# EAGLE design wimax-cpe (EAGLE 9.6.2)
WiMAX CPE Wallplug: mains-powered PCI Express Mini Card carrier for an IEEE 802.16e WiMAX modem (Intel Centrino Advanced-N + WiMAX 6250), USB 2.0 to the host
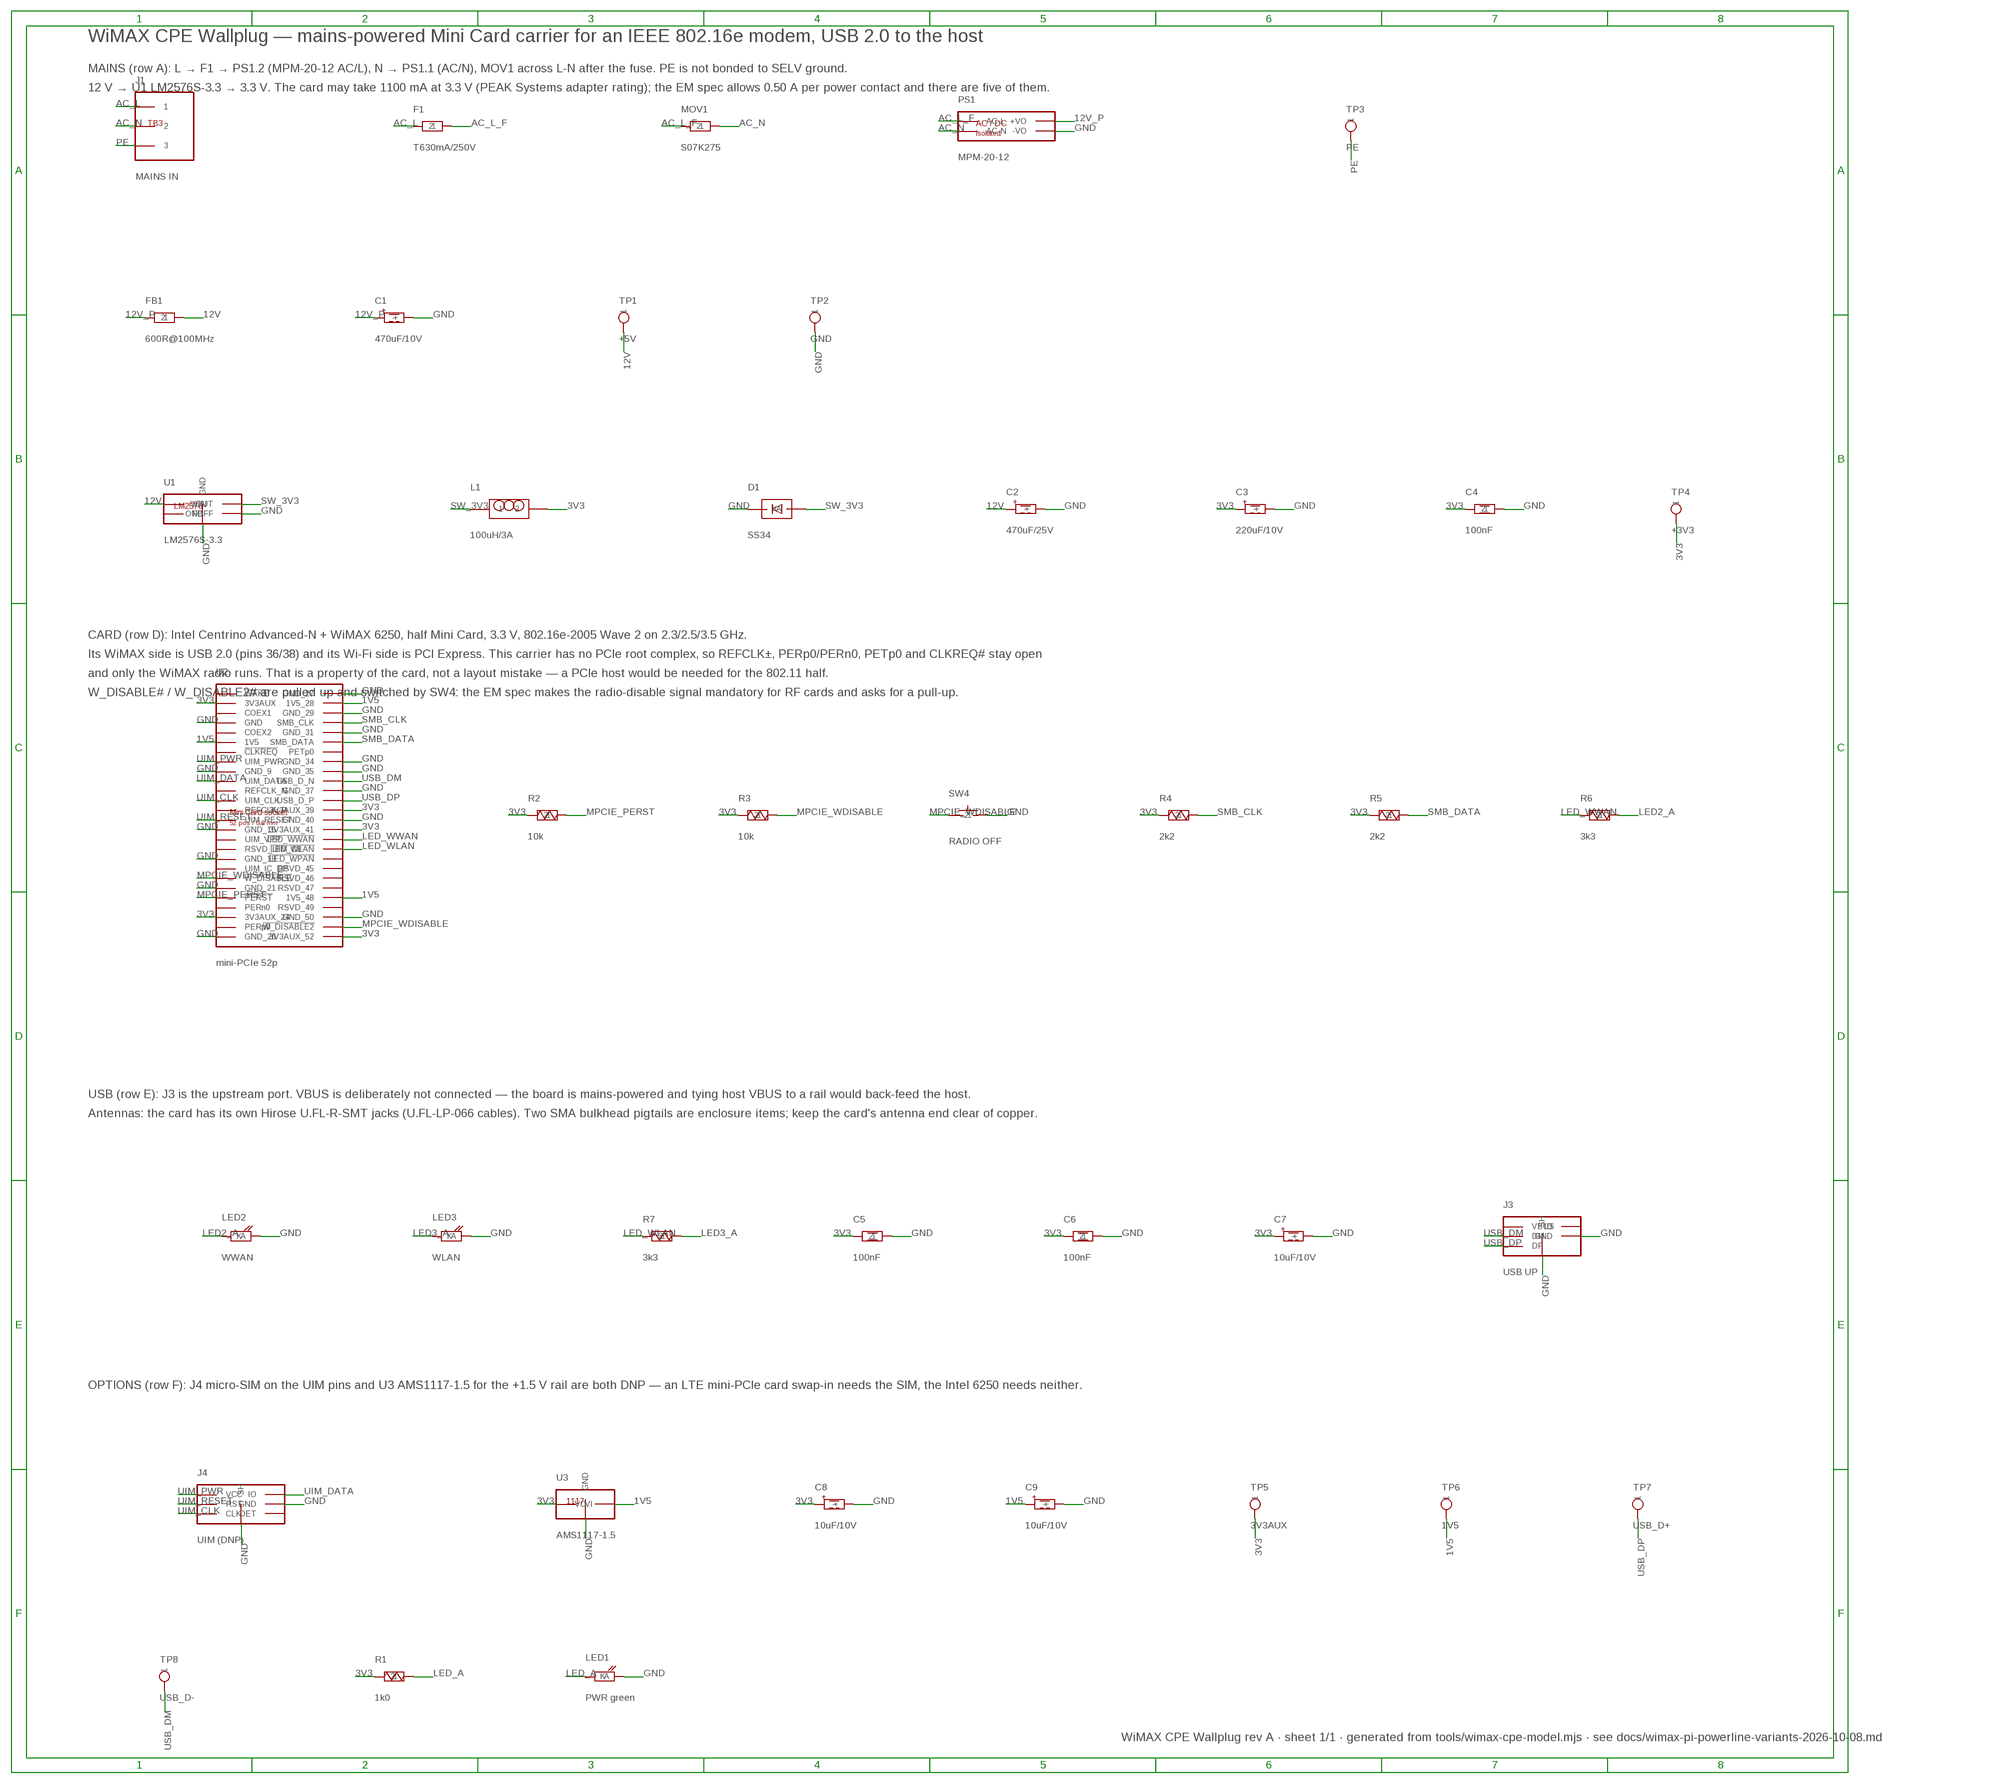
[diagram p0: schematic, sheet 1]

## Parts
C1  470uF/10V  CPOL-EU  [CP-D10-P5]
C2  470uF/25V  CPOL-EU  [CP-D10-P5]
C3  220uF/10V  CPOL-EU  [CP-D10-P5]
C4  100nF  C-0603  [C0603]
C5  100nF  C-0603  [C0603]
C6  100nF  C-0603  [C0603]
C7  10uF/10V  CPOL-SMALL  [CP-D6.3-P2.5]
C8  10uF/10V  CPOL-SMALL  [CP-D6.3-P2.5]
C9  10uF/10V  CPOL-SMALL  [CP-D6.3-P2.5]
D1  SS34  DIODE-SCH  [DO41]
F1  T630mA/250V  FUSE  [FUSE-RADIAL]
FB1  600R@100MHz  FERRITE  [FB-7.62]
J1  MAINS IN  TERM-3  [CUI_TB003]
J3  USB UP  USB-MICRO-B  [USBMB]
J4  UIM (DNP)  MICRO-SIM  [MICROSIM]
L1  100uH/3A  L-RADIAL  [LRAD12]
LED1  PWR green  LED  [LED-5MM]
LED2  WWAN  LED  [LED-5MM]
LED3  WLAN  LED  [LED-5MM]
MOV1  S07K275  MOV  [MOV07]
PS1  MPM-20-12  ACDC-12V  [MPM2012]
R1  1k0  R-EU  [R-7.62]
R2  10k  R-EU  [R-7.62]
R3  10k  R-EU  [R-7.62]
R4  2k2  R-EU  [R-7.62]
R5  2k2  R-EU  [R-7.62]
R6  3k3  R-EU  [R-7.62]
R7  3k3  R-EU  [R-7.62]
SW4  RADIO OFF  SW-PUSH  [SW-TACT-6MM]
TP1  +5V  TP  [TP]
TP2  GND  TP  [TP]
TP3  PE  TP  [TP]
TP4  +3V3  TP  [TP]
TP5  3V3AUX  TP  [TP]
TP6  1V5  TP  [TP]
TP7  USB_D+  TP  [TP]
TP8  USB_D-  TP  [TP]
U1  LM2576S-3.3  BUCK-3V3  [LM2576S]
U2  mini-PCIe 52p  MPCIE-SOCKET  [MPCIE]
U3  AMS1117-1.5  LDO-3V3  [AMS1117]

## Nets
1V5 [power]: C9.+ TP6.1 U2.6(1V5) U2.28(1V5_28) U2.48(1V5_48) U3.2(VO) U3.2_2(VO)
3V3 [power]: C3.+ C4.1 C5.1 C6.1 C7.+ C8.+ L1.2 R1.1 R2.1 R3.1 R4.1 R5.1 TP4.1 TP5.1 U2.2(3V3AUX) U2.24(3V3AUX_24) U2.39(3V3AUX_39) U2.41(3V3AUX_41) U2.52(3V3AUX_52) U3.3(VI)
12V [power]: C2.+ FB1.2 TP1.1 U1.1(VIN)
12V_P [power]: C1.+ FB1.1 PS1.3(+VO)
AC_L [mains]: F1.1 J1.1
AC_L_F [mains]: F1.2 MOV1.1 PS1.2(AC-L)
AC_N [mains]: J1.2 MOV1.2 PS1.1(AC-N)
GND [power]: C1.- C2.- C3.- C4.2 C5.2 C6.2 C7.- C8.- C9.- D1.A J3.5(GND) J3.6(SH) J3.6_2(SH) J3.6_3(SH) J3.6_4(SH) J3.6_5(SH) J3.6_6(SH) J3.6_7(SH) J3.6_8(SH) J4.5(GND) J4.SH J4.SH_2(SH) J4.SH_3(SH) J4.SH_4(SH) J4.SH_5(SH) J4.SH_6(SH) J4.SH_7(SH) J4.SH_8(SH) LED1.2(K) LED2.2(K) LED3.2(K) PS1.4(-VO) SW4.2 TP2.1 U1.3(GND) U1.3_2(GND) U1.5(ONOFF) U1.P7(GND) U1.P8(GND) U1.P9(GND) U1.P10(GND) U2.4(GND) U2.9(GND_9) U2.15(GND_15) U2.18(GND_18) U2.21(GND_21) U2.26(GND_26) U2.27(GND_27) U2.29(GND_29) U2.31(GND_31) U2.34(GND_34) U2.35(GND_35) U2.37(GND_37) U2.40(GND_40) U2.50(GND_50) U3.1(GND)
LED2_A: LED2.1(A) R6.2
LED3_A: LED3.1(A) R7.2
LED_A: LED1.1(A) R1.2
LED_WLAN: R7.1 U2.43(!LED_WLAN)
LED_WWAN: R6.1 U2.42(!LED_WWAN)
MPCIE_PERST: R2.2 U2.22(!PERST)
MPCIE_WDISABLE: R3.2 SW4.1 U2.20(!W_DISABLE) U2.51(!W_DISABLE2)
PE [mains]: J1.3 TP3.1
SMB_CLK: R4.2 U2.30(SMB_CLK)
SMB_DATA: R5.2 U2.32(SMB_DATA)
SW_3V3 [power]: D1.K L1.1 U1.2(VOUT)
UIM_CLK: J4.3(CLK) U2.12(UIM_CLK)
UIM_DATA: J4.7(IO) U2.10(UIM_DATA)
UIM_PWR: J4.1(VCC) U2.8(UIM_PWR)
UIM_RESET: J4.2(RST) U2.14(UIM_RESET)
USB_DM: J3.2(DM) TP8.1 U2.36(USB_D_N)
USB_DP: J3.3(DP) TP7.1 U2.38(USB_D_P)
Unconnected: J3.1(VBUS) J3.4(ID) J4.6(DET) U1.4(FB) U2.1(!WAKE) U2.3(COEX1) U2.5(COEX2) U2.7(!CLKREQ) U2.11(REFCLK_N) U2.13(REFCLK_P) U2.16(UIM_VPP) U2.17(RSVD_UIM_C8) U2.19(UIM_IC_DP) U2.23(PERn0) U2.25(PERp0) U2.33(PETp0) U2.44(!LED_WPAN) U2.45(RSVD_45) U2.46(RSVD_46) U2.47(RSVD_47) U2.49(RSVD_49)

## Notes on the sheet
- WiMAX CPE Wallplug — mains-powered Mini Card carrier for an IEEE 802.16e modem, USB 2.0 to the host
- MAINS (row A): L → F1 → PS1.2 (MPM-20-12 AC/L), N → PS1.1 (AC/N), MOV1 across L-N after the fuse. PE is not bonded to SELV ground.
- 12 V → U1 LM2576S-3.3 → 3.3 V. The card may take 1100 mA at 3.3 V (PEAK Systems adapter rating); the EM spec allows 0.50 A per power contact and there are five of them.
- CARD (row D): Intel Centrino Advanced-N + WiMAX 6250, half Mini Card, 3.3 V, 802.16e-2005 Wave 2 on 2.3/2.5/3.5 GHz.
- Its WiMAX side is USB 2.0 (pins 36/38) and its Wi-Fi side is PCI Express. This carrier has no PCIe root complex, so REFCLK±, PERp0/PERn0, PETp0 and CLKREQ# stay open
- and only the WiMAX radio runs. That is a property of the card, not a layout mistake — a PCIe host would be needed for the 802.11 half.
- W_DISABLE# / W_DISABLE2# are pulled up and switched by SW4: the EM spec makes the radio-disable signal mandatory for RF cards and asks for a pull-up.
- USB (row E): J3 is the upstream port. VBUS is deliberately not connected — the board is mains-powered and tying host VBUS to a rail would back-feed the host.
- Antennas: the card has its own Hirose U.FL-R-SMT jacks (U.FL-LP-066 cables). Two SMA bulkhead pigtails are enclosure items; keep the card's antenna end clear of copper.
- OPTIONS (row F): J4 micro-SIM on the UIM pins and U3 AMS1117-1.5 for the +1.5 V rail are both DNP — an LTE mini-PCIe card swap-in needs the SIM, the Intel 6250 needs neither.
- WiMAX CPE Wallplug rev A · sheet 1/1 · generated from tools/wimax-cpe-model.mjs · see docs/wimax-pi-powerline-variants-2026-10-08.md

## Library data of the parts
C1-C3 = wimax-cpe:CPOL-EU
C4-C6 = wimax-cpe:C-0603
C7-C9 = wimax-cpe:CPOL-SMALL
D1 = wimax-cpe:DIODE-SCH
F1 = wimax-cpe:FUSE
FB1 = wimax-cpe:FERRITE
J1 = wimax-cpe:TERM-3
J3 = wimax-cpe:USB-MICRO-B
J4 = wimax-cpe:MICRO-SIM
L1 = wimax-cpe:L-RADIAL
LED1-LED3 = wimax-cpe:LED
MOV1 = wimax-cpe:MOV
PS1 = wimax-cpe:ACDC-12V
R1-R7 = wimax-cpe:R-EU
SW4 = wimax-cpe:SW-PUSH
TP1-TP8 = wimax-cpe:TP
U1 = wimax-cpe:BUCK-3V3
U2 = wimax-cpe:MPCIE-SOCKET
U3 = wimax-cpe:LDO-3V3

## Net classes
0 default: width 0.305 mm
1 mains: width 2.5 mm, clearance 6.4 mm to class 0, clearance 6.4 mm, clearance 6.4 mm to class 2
2 power: width 1 mm, clearance 0.5 mm to class 0, clearance 0.6 mm

## Board
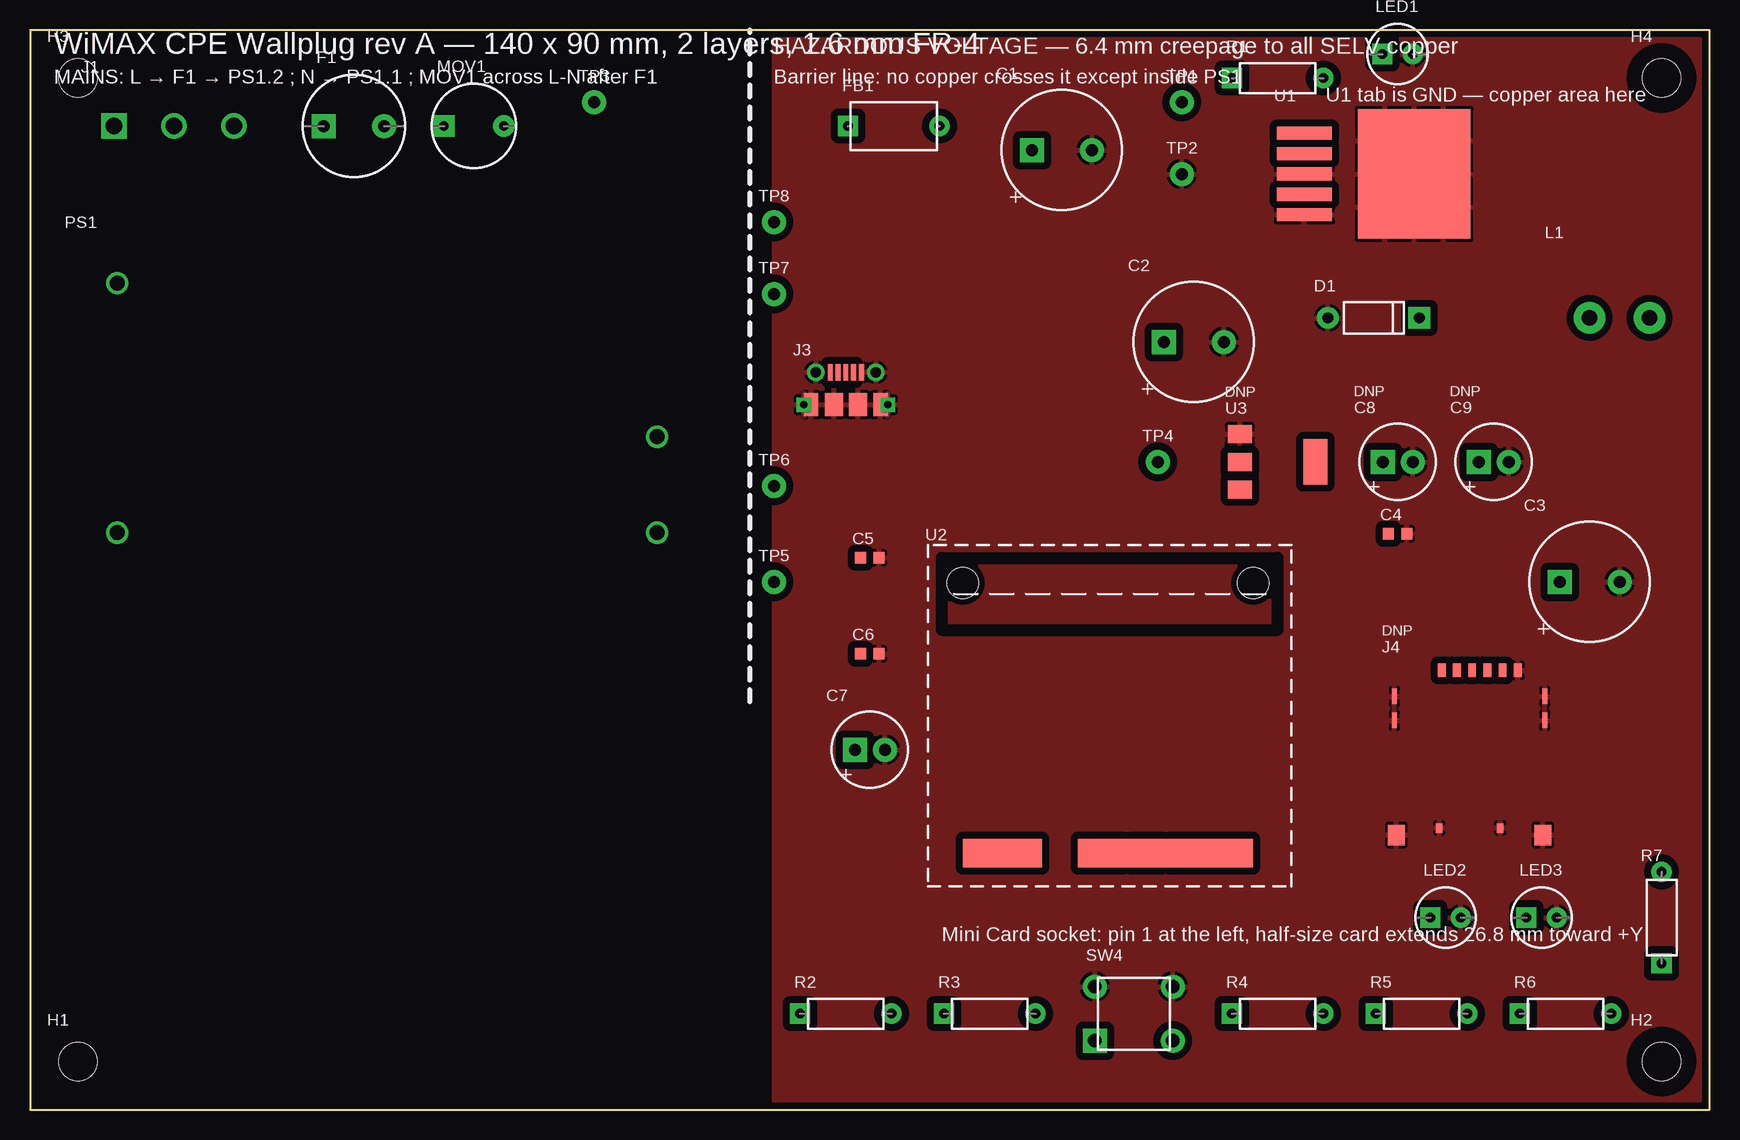
[diagram p1: board, top side]
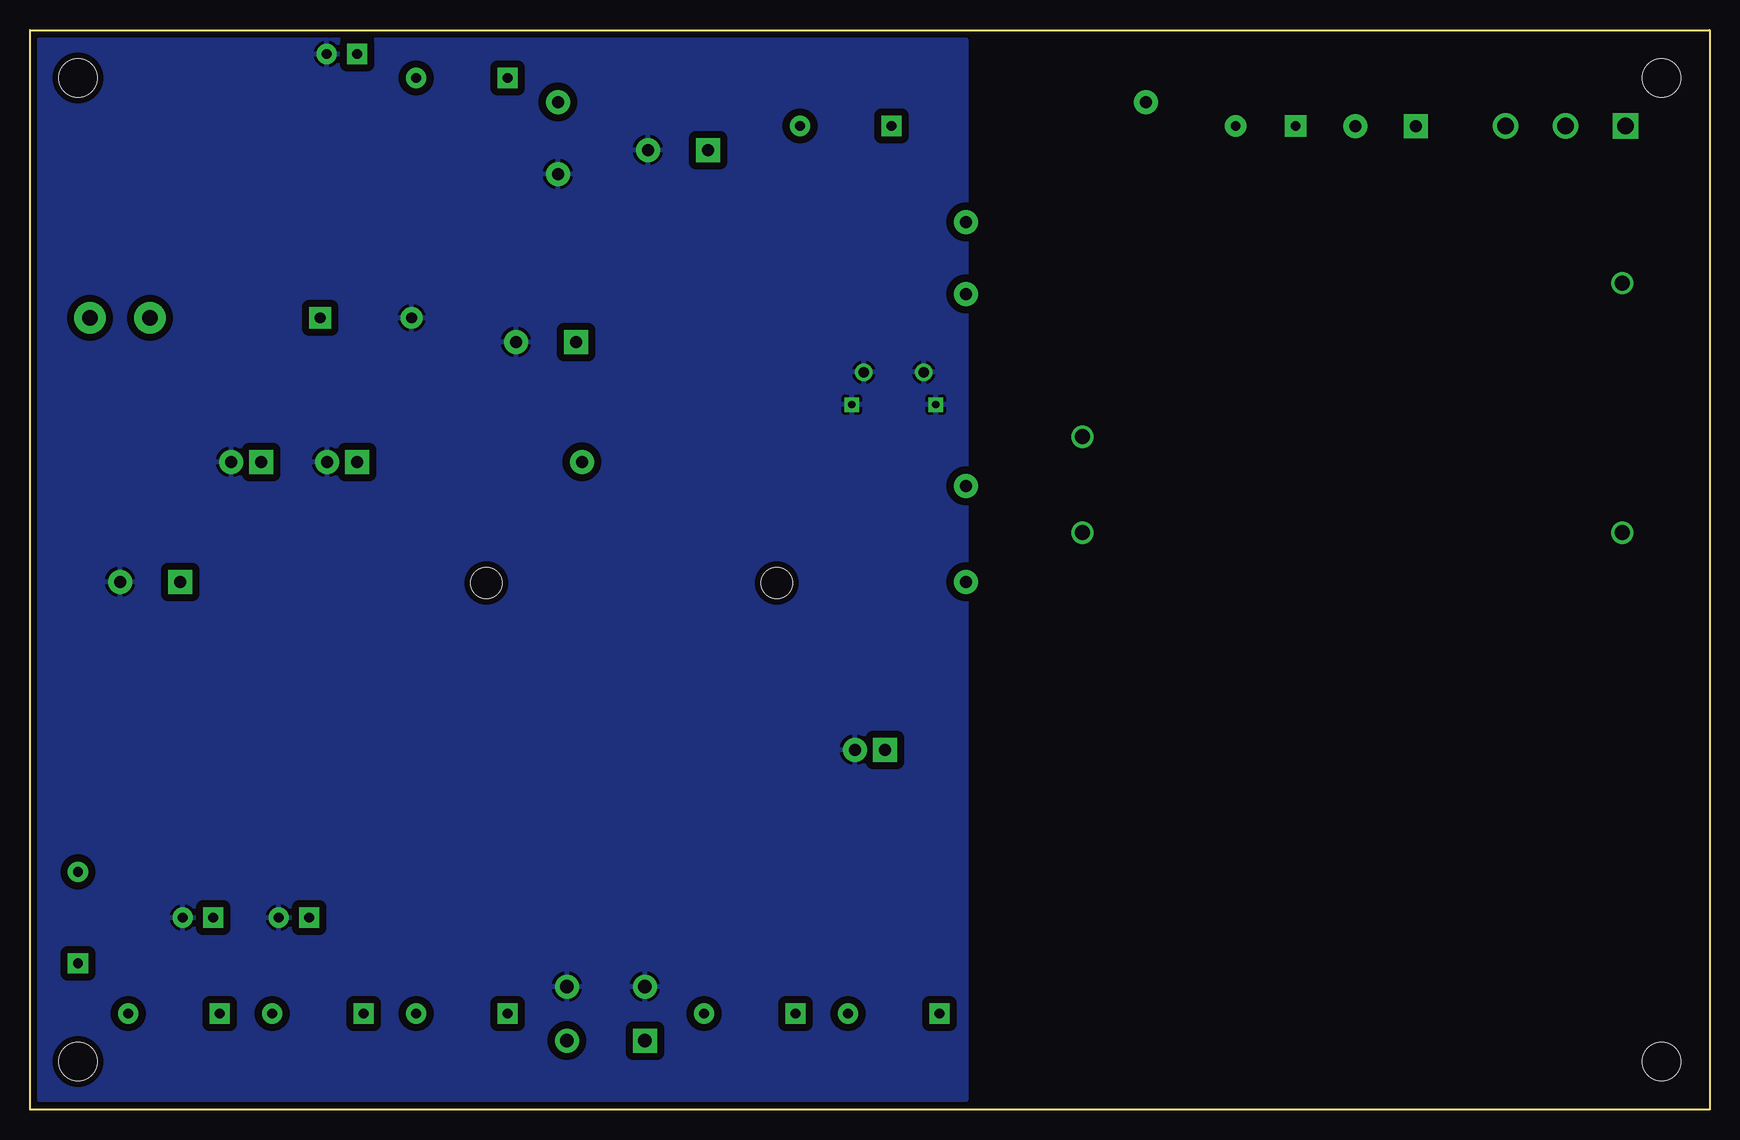
[diagram p2: board, bottom side, seen from below]

Size 140 x 90 mm. Coordinates in mm from the lower left corner, seen from the top.
Outline: 0,0 140,0 140,90 0,90 0,0
Copper layers (1*16): Top 0.035mm / dielectric 1.5mm / Bottom 0.035mm
Design rules "wimax-cpe-2layer": minimum track width 8mil, minimum drill 0.35mm, track to track 8mil, track to pad 8mil, pad to pad 8mil, via to via 8mil, smd to smd 0mil, copper to edge 20mil, drill to drill 8mil, minimum pad ring 10mil, minimum via ring 8mil, stop-mask expansion 4mil, vias tented up to drill 25mil, thermal gap 10mil
tRestrict: 5 lines

### Footprints (pad centres in the part's own frame; a part is rotated, then mirrored left to right if it is on the bottom)
CP-D10-P5 = drill 1 pad 2 square: + -2.5,0 | drill 1 pad 2: - 2.5,0
C0603 = smd 0.9 x 0.95: 1 -0.775,0; 2 0.775,0
CP-D6.3-P2.5 = drill 1 pad 2 square: + -1.25,0 | drill 1 pad 2: - 1.25,0
DO41 = drill 0.9 pad 1.8: A -3.81,0 | drill 0.9 pad 1.8 square: K 3.81,0
FUSE-RADIAL = drill 1 pad 2 square: 1 -2.54,0 | drill 1 pad 2: 2 2.54,0
FB-7.62 = drill 0.8 pad 1.7 square: 1 -3.81,0 | drill 0.8 pad 1.7: 2 3.81,0
MOUNT-M3 = hole 3.2: 0,0
CUI_TB003 = drill 1.4 pad 2.1 square: 1 -5,0 | drill 1.4 pad 2.1: 2 0,0; 3 5,0
USBMB = smd 0.4 x 1.35: 1 -1.3,1.462; 2 -0.65,1.462; 3 0,1.462; 4 0.65,1.462; 5 1.3,1.462 | smd 1.5 x 1.9: 6 1,-1.238; 6_4 -1,-1.238 | drill 0.85 pad 1.45: 6_2 -2.5,1.462; 6_3 2.5,1.462 | drill 0.6 pad 1.2 square: 6_5 -3.5,-1.238; 6_6 3.5,-1.238 | smd 1.2 x 1.9: 6_7 2.9,-1.238; 6_8 -2.9,-1.238
MICROSIM = smd 0.65 x 1.15: 1 2.755,6.62; 2 0.215,6.62; 3 -2.325,6.62; 5 4.025,6.62; 6 1.485,6.62; 7 -1.055,6.62 | smd 1.4 x 1.7: SH -6.105,-7.11; SH_2 6.105,-7.11 | smd 0.45 x 1.3: SH_3 -6.27,2.45; SH_4 -6.27,4.45; SH_5 6.27,2.45; SH_6 6.27,4.45 | smd 0.54 x 0.8: SH_7 -2.535,-6.53; SH_8 2.545,-6.53
LRAD12 = drill 1.3 pad 2.6: 1 0,0; 2 5,0
LED-5MM = drill 0.8 pad 1.7 square: 1 -1.27,0 | drill 0.8 pad 1.7: 2 1.27,0
MOV07 = drill 0.8 pad 1.8 square: 1 -2.5,0 | drill 0.8 pad 1.8: 2 2.5,0
MPM2012 = drill 1.24 pad 1.86: 1 22.733,9.906; 2 22.733,-10.894; 3 -22.267,1.906; 4 -22.267,9.906
R-7.62 = drill 0.8 pad 1.7 square: 1 -3.81,0 | drill 0.8 pad 1.7: 2 3.81,0
SW-TACT-6MM = drill 1.1 pad 2 square: 1 -3.25,-2.25 | drill 1.1 pad 2: 1 3.25,-2.25; 2 -3.25,2.25; 2 3.25,2.25
TP = drill 1 pad 2: 1 0,0
LM2576S = smd 4.6 x 1.1: 1 -5.775,3.4; 2 -5.775,1.7; 3 -5.775,0; 4 -5.775,-1.7; 5 -5.775,-3.4 | smd 9.4 x 10.8: 3_2 3.375,0 | smd 4.55 x 5.25: P7 5.8,-2.775; P8 0.95,2.775; P9 5.8,2.775; P10 0.95,-2.775
MPCIE = smd 0.6 x 2.35: 1 -7.95,1.375; 2 -7.55,1.375; 3 -7.15,1.375; 4 -6.75,1.375; 5 -6.35,1.375; 6 -5.95,1.375; 7 -5.55,1.375; 8 -5.15,1.375; 9 -4.75,1.375; 10 -4.35,1.375; 11 -3.95,1.375; 12 -3.55,1.375; 13 -3.15,1.375; 14 -2.75,1.375; 15 -2.35,1.375; 16 -1.95,1.375; 17 1.65,1.375; 18 2.05,1.375; 19 2.45,1.375; 20 2.85,1.375; 21 3.25,1.375; 22 3.65,1.375; 23 4.05,1.375; 24 4.45,1.375; 25 4.85,1.375; 26 5.25,1.375; 27 5.65,1.375; 28 6.05,1.375; 29 6.45,1.375; 30 6.85,1.375; 31 7.25,1.375; 32 7.65,1.375; 33 8.05,1.375; 34 8.45,1.375; 35 8.85,1.375; 36 9.25,1.375; 37 9.65,1.375; 38 10.05,1.375; 39 10.45,1.375; 40 10.85,1.375; 41 11.25,1.375; 42 11.65,1.375; 43 12.05,1.375; 44 12.45,1.375; 45 12.85,1.375; 46 13.25,1.375; 47 13.65,1.375; 48 14.05,1.375; 49 14.45,1.375; 50 14.85,1.375; 51 15.25,1.375; 52 15.65,1.375 | hole 2.6: -8.25,23.9; 15.95,23.9
AMS1117 = smd 2 x 1.5: 1 -3.15,2.3; 2_2 -3.15,0; 3 -3.15,-2.3 | smd 2 x 3.8: 2 3.15,0

### Placement (x,y rotation side)
C1  86,80 0 top
C2  97,64 0 top
C3  130,44 0 top
C4  114,48 0 top
C5  70,46 0 top
C6  70,38 0 top
C7  70,30 0 top
C8  114,54 0 top
C9  122,54 0 top
D1  112,66 0 top
F1  27,82 0 top
FB1  72,82 0 top
H1  [MOUNT-M3]  4,4 0 top
H2  [MOUNT-M3]  136,4 0 top
H3  [MOUNT-M3]  4,86 0 top
H4  [MOUNT-M3]  136,86 0 top
J1  12,82 0 top
J3  68,60 0 top
J4  120,30 0 top
L1  130,66 0 top
LED1  114,88 0 top
LED2  118,16 0 top
LED3  126,16 0 top
MOV1  37,82 0 top
PS1  30,58 180 top
R1  104,86 0 top
R2  68,8 0 top
R3  80,8 0 top
R4  104,8 0 top
R5  116,8 0 top
R6  128,8 0 top
R7  136,16 90 top
SW4  92,8 0 top
TP1  96,84 0 top
TP2  96,78 0 top
TP3  47,84 0 top
TP4  94,54 0 top
TP5  62,44 0 top
TP6  62,52 0 top
TP7  62,68 0 top
TP8  62,74 0 top
U1  112,78 0 top
U2  86,20 0 top
U3  104,54 0 top

### Tracks (layer width: path | path; a pad name or v marks a point on that pad's centre or on a via)
GND
  pour Top (isolate 0.4, rank 2): 62,0.8 139.2,0.8 139.2,89.2 62,89.2
  pour Bottom (isolate 0.4, rank 2): 62,0.8 139.2,0.8 139.2,89.2 62,89.2

### Text on the board
tPlace: WiMAX CPE Wallplug rev A — 140 x 90 mm, 2 layers, 1.6 mm FR-4 | HAZARDOUS VOLTAGE — 6.4 mm creepage to all SELV copper | MAINS: L → F1 → PS1.2 ; N → PS1.1 ; MOV1 across L-N after F1 | Barrier line: no copper crosses it except inside PS1 | U1 tab is GND — copper area here | Mini Card socket: pin 1 at the left, half-size card extends 26.8 mm toward +Y